# EasyEDA schematic SCH_PLU-Piano-v1.0_2024-04-26.json
TITLE: Player Piano Controller; REV: 1.0; Date: 2023-11-11; Sheet: 1/1; Drawn By: Eric Golde; Company: PLU Capstone
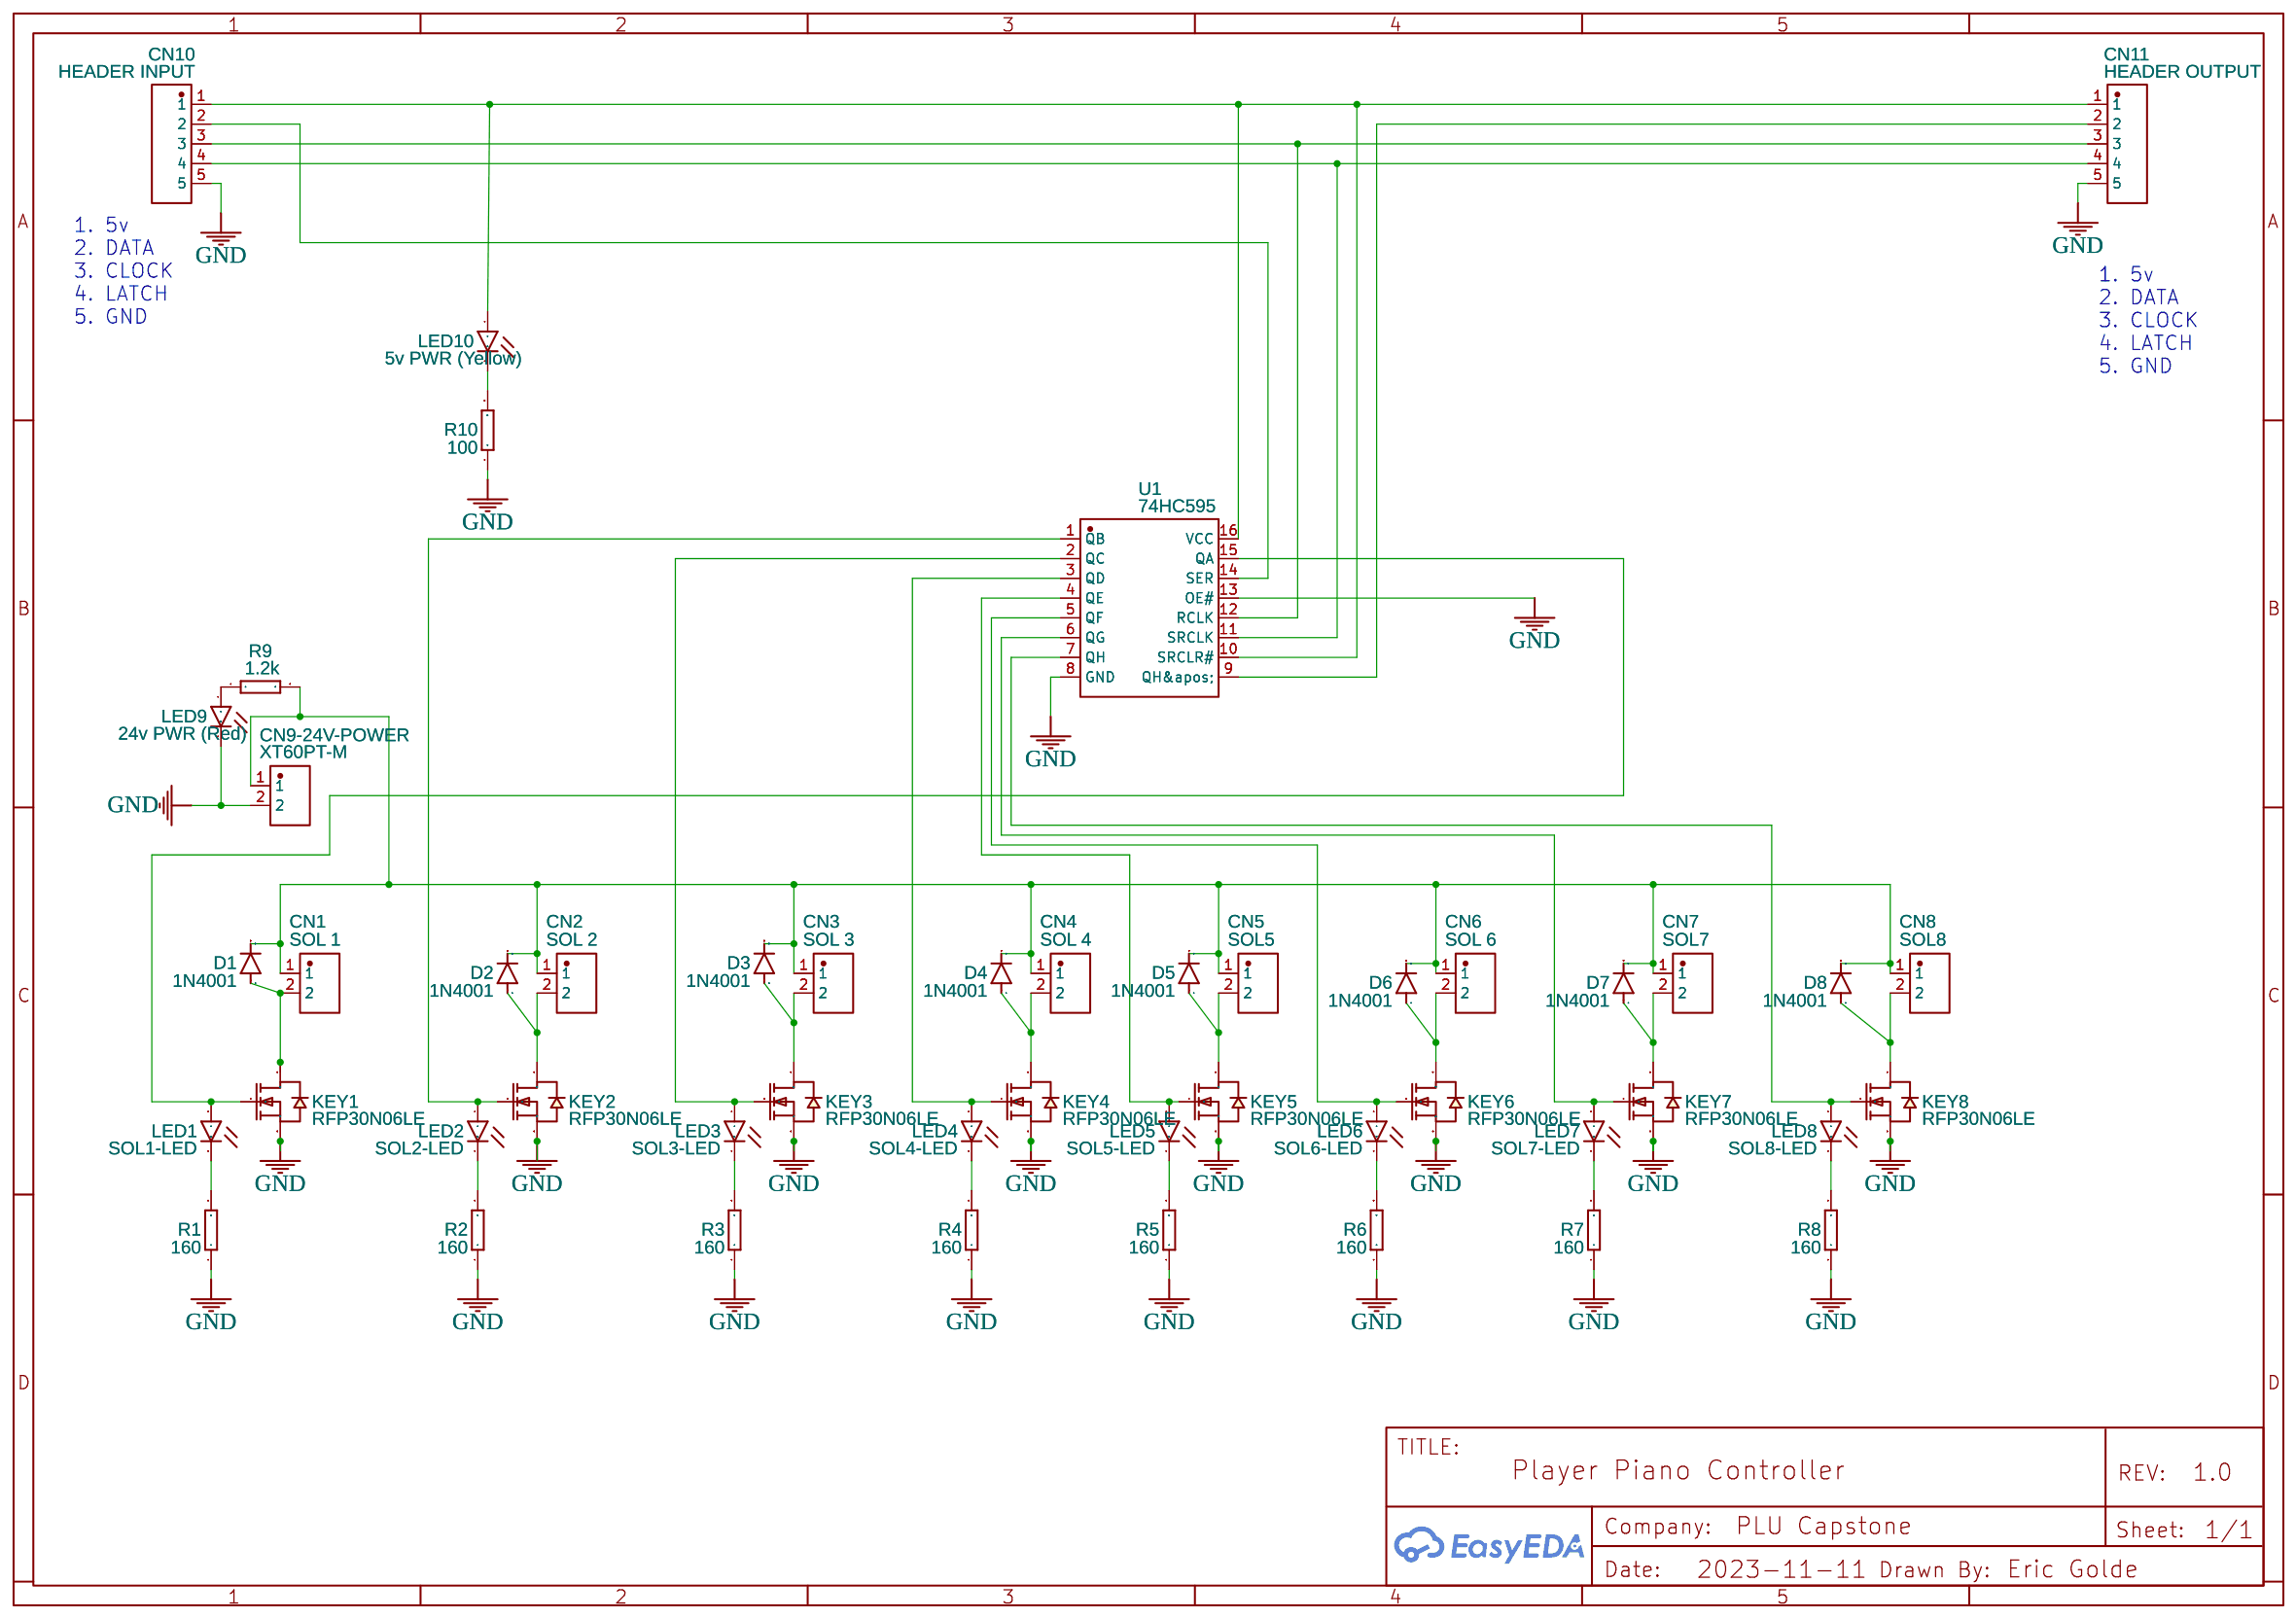
[diagram p0: schematic sheet]

## Parts
CN1  SOL 1  [CONN-TH_2P-P4.00_VH2-HEADER2]
CN2  SOL 2  [CONN-TH_2P-P4.00_VH2-HEADER2]
CN3  SOL 3  [CONN-TH_2P-P4.00_VH2-HEADER2]
CN4  SOL 4  [CONN-TH_2P-P4.00_VH2-HEADER2]
CN5  SOL5  [CONN-TH_2P-P4.00_VH2-HEADER2]
CN6  SOL 6  [CONN-TH_2P-P4.00_VH2-HEADER2]
CN7  SOL7  [CONN-TH_2P-P4.00_VH2-HEADER2]
CN8  SOL8  [CONN-TH_2P-P4.00_VH2-HEADER2]
CN9-24V-POWER  XT60PT-M  [CONN-TH_XT60PT-M]
CN10  HEADER INPUT  [CONN-TH_HEADER5]
CN11  HEADER OUTPUT  [CONN-TH_HEADER5]
D1  1N4001  [DIODE-1N4148]
D2  1N4001  [DIODE-1N4148]
D3  1N4001  [DIODE-1N4148]
D4  1N4001  [DIODE-1N4148]
D5  1N4001  [DIODE-1N4148]
D6  1N4001  [DIODE-1N4148]
D7  1N4001  [DIODE-1N4148]
D8  1N4001  [DIODE-1N4148]
KEY1  RFP30N06LE  [TO-220AB-3_L10.3-W4.5-P2.54-L-1]
KEY2  RFP30N06LE  [TO-220AB-3_L10.3-W4.5-P2.54-L-1]
KEY3  RFP30N06LE  [TO-220AB-3_L10.3-W4.5-P2.54-L-1]
KEY4  RFP30N06LE  [TO-220AB-3_L10.3-W4.5-P2.54-L-1]
KEY5  RFP30N06LE  [TO-220AB-3_L10.3-W4.5-P2.54-L-1]
KEY6  RFP30N06LE  [TO-220AB-3_L10.3-W4.5-P2.54-L-1]
KEY7  RFP30N06LE  [TO-220AB-3_L10.3-W4.5-P2.54-L-1]
KEY8  RFP30N06LE  [TO-220AB-3_L10.3-W4.5-P2.54-L-1]
LED1  SOL1-LED  [LED5MM]
LED2  SOL2-LED  [LED5MM]
LED3  SOL3-LED  [LED5MM]
LED4  SOL4-LED  [LED5MM]
LED5  SOL5-LED  [LED5MM]
LED6  SOL6-LED  [LED5MM]
LED7  SOL7-LED  [LED5MM]
LED8  SOL8-LED  [LED5MM]
LED9  24v PWR (Red)  [LED5MM]
LED10  5v PWR (Yellow)  [LED5MM]
R1  160  [RTH025W]
R2  160  [RTH025W]
R3  160  [RTH025W]
R4  160  [RTH025W]
R5  160  [RTH025W]
R6  160  [RTH025W]
R7  160  [RTH025W]
R8  160  [RTH025W]
R9  1.2k  [RTH025W]
R10  100  [RTH025W]
U1  74HC595  [PDIP-16_L19.7-W6.6-P2.54-LS7.6-BL]

## Library data of the parts
CN1-CN8 = VH2-HEADER2: Contributor: LCSC; Supplier: LCSC; Supplier Part: C9900011009; Manufacturer: null; Manufacturer Part: VH2-Header2; JLCPCB Part Class: Extended Part; link: https://lcsc.com/eda_search?q=C9900011009&%26type=1&ref=editor
CN9-24V-POWER = XT60PT-M: Contributor: lcsc; Supplier: LCSC; Supplier Part: C5155958; Manufacturer: null; link: https://lcsc.com/eda_search?q=C5155958&%26type=1&ref=editor
CN10 CN11 = HEADER5: Contributor: LCSC; Supplier: LCSC; Supplier Part: C9900003337; Manufacturer: null; Manufacturer Part: Header5; JLCPCB Part Class: Extended Part; link: https://lcsc.com/eda_search?q=C9900003337&%26type=1&ref=editor
D1-D8 = DIODE1N4148: Diode; Contributor: SparkFun
KEY1-KEY8 = RFP30N06LE: Contributor: LCSC; Supplier: LCSC; Supplier Part: C878812; Manufacturer: VBsemi(微碧); Manufacturer Part: RFP30N06LE-VB; JLCPCB Part Class: Extended Part; link: https://lcsc.com/eda_search?q=C878812&%26type=1&ref=editor
LED1-LED10 = LED-IR-THRUTSAL6100: Contributor: SparkFun
R1-R10 = RESISTOR: Contributor: DangerousPrototype
U1 = SN74HC595NE4: Contributor: lcsc; Supplier: LCSC; Supplier Part: C3303991; Manufacturer: TI(德州仪器); link: https://lcsc.com/eda_search?q=C3303991&%26type=1&ref=editor

## Nets
GND: CN9-24V-POWER.2 CN10.5 CN11.5 KEY1.3(S) KEY2.3(S) KEY3.3(S) KEY4.3(S) KEY5.3(S) KEY6.3(S) KEY7.3(S) KEY8.3(S) LED9.K(C) R1.1 R2.1 R3.1 R4.1 R5.1 R6.1 R7.1 R8.1 R10.1 U1.8(GND) U1.13(OE#)
Net-(CN1-1): CN1.1 CN2.1 CN3.1 CN4.1 CN5.1 CN6.1 CN7.1 CN8.1 CN9-24V-POWER.1 D1.C D2.C D3.C D4.C D5.C D6.C D7.C D8.C R9.2
Net-(CN1-2): CN1.2 D1.A KEY1.2(D)
Net-(CN2-2): CN2.2 D2.A KEY2.2(D)
Net-(CN3-2): CN3.2 D3.A KEY3.2(D)
Net-(CN4-2): CN4.2 D4.A KEY4.2(D)
Net-(CN5-2): CN5.2 D5.A KEY5.2(D)
Net-(CN6-2): CN6.2 D6.A KEY6.2(D)
Net-(CN7-2): CN7.2 D7.A KEY7.2(D)
Net-(CN8-2): CN8.2 D8.A KEY8.2(D)
Net-(CN10-1): CN10.1 CN11.1 LED10.A U1.10(SRCLR#) U1.16(VCC)
Net-(CN10-2): CN10.2 U1.14(SER)
Net-(CN10-3): CN10.3 CN11.3 U1.12(RCLK)
Net-(CN10-4): CN10.4 CN11.4 U1.11(SRCLK)
Net-(CN11-2): CN11.2 U1.9(QH')
Net-(KEY1-1): KEY1.1(G) LED1.A U1.15(QA)
Net-(KEY2-1): KEY2.1(G) LED2.A U1.1(QB)
Net-(KEY3-1): KEY3.1(G) LED3.A U1.2(QC)
Net-(KEY4-1): KEY4.1(G) LED4.A U1.3(QD)
Net-(KEY5-1): KEY5.1(G) LED5.A U1.4(QE)
Net-(KEY6-1): KEY6.1(G) LED6.A U1.5(QF)
Net-(KEY7-1): KEY7.1(G) LED7.A U1.6(QG)
Net-(KEY8-1): KEY8.1(G) LED8.A U1.7(QH)
Net-(LED1-K): LED1.K(C) R1.2
Net-(LED2-K): LED2.K(C) R2.2
Net-(LED3-K): LED3.K(C) R3.2
Net-(LED4-K): LED4.K(C) R4.2
Net-(LED5-K): LED5.K(C) R5.2
Net-(LED6-K): LED6.K(C) R6.2
Net-(LED7-K): LED7.K(C) R7.2
Net-(LED8-K): LED8.K(C) R8.2
Net-(LED9-A): LED9.A R9.1
Net-(LED10-K): LED10.K(C) R10.2

## Notes on the sheet
- 1. 5v
  2. DATA
  3. CLOCK
  4. LATCH
  5. GND
- 1. 5v
  2. DATA
  3. CLOCK
  4. LATCH
  5. GND
